# Altium schematic sheet Adapter.SchDoc
size A4
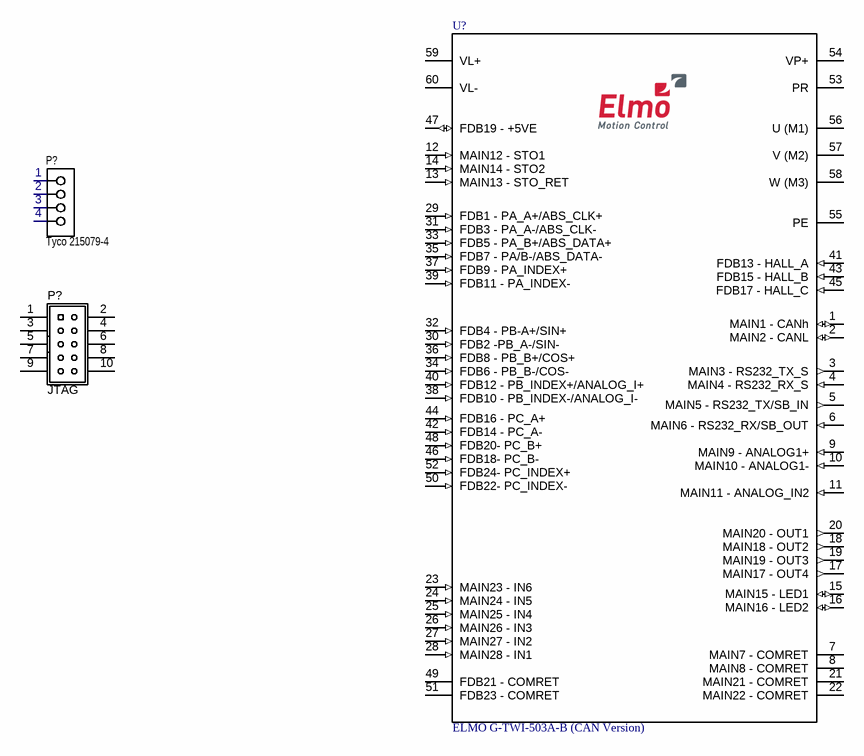
[diagram p0: Adapter.SchDoc]

## Parts
(Parts that share a designator on the sheet are numbered #1, #2 ... from top to bottom, then left to right.)
P?#1  Tyco 215079-4  [TYCO/215079-4]
P?#2  JTAG  [HE/2.54/10/1]
U?  ELMO G-TWI-503A-B (CAN Version)

## Nets

Not connected (* = marked no-connect by the designer): P?#1 1 2 3 4; P?#2 1 2 3 4 5 6 7 8 9 10; U? 1(MAIN1_-_CANh) 2(MAIN2_-_CANL) 3(MAIN3_-_RS232_TX_S) 4(MAIN4_-_RS232_RX_S) 5(MAIN5_-_RS232_TX/SB_IN) 6(MAIN6_-_RS232_RX/SB_OUT) 7(MAIN7_-_COMRET) 8(MAIN8_-_COMRET) 9(MAIN9_-_ANALOG1+) 10(MAIN10_-_ANALOG1-) 11(MAIN11_-_ANALOG_IN2) 12(MAIN12_-_STO1) 13(MAIN13_-_STO_RET) 14(MAIN14_-_STO2) 15(MAIN15_-_LED1) 16(MAIN16_-_LED2) 17(MAIN17_-_OUT4) 18(MAIN18_-_OUT2) 19(MAIN19_-_OUT3) 20(MAIN20_-_OUT1) 21(MAIN21_-_COMRET) 22(MAIN22_-_COMRET) 23(MAIN23_-_IN6) 24(MAIN24_-_IN5) 25(MAIN25_-_IN4) 26(MAIN26_-_IN3) 27(MAIN27_-_IN2) 28(MAIN28_-_IN1) 29(FDB1_-_PA_A+/ABS_CLK+) 30(FDB2_-PB_A-/SIN-) 31(FDB3_-_PA_A-/ABS_CLK-) 32(FDB4_-_PB-A+/SIN+) 33(FDB5_-_PA_B+/ABS_DATA+) 34(FDB6_-_PB_B-/COS-) 35(FDB7_-_PA/B-/ABS_DATA-) 36(FDB8_-_PB_B+/COS+) 37(FDB9_-_PA_INDEX+) 38(FDB10_-_PB_INDEX-/ANALOG_I-) 39(FDB11_-_PA_INDEX-) 40(FDB12_-_PB_INDEX+/ANALOG_I+) 41(FDB13_-_HALL_A) 42(FDB14_-_PC_A-) 43(FDB15_-_HALL_B) 44(FDB16_-_PC_A+) 45(FDB17_-_HALL_C) 46(FDB18-_PC_B-) 47(FDB19_-_+5VE) 48(FDB20-_PC_B+) 49(FDB21_-_COMRET) 50(FDB22-_PC_INDEX-) 51(FDB23_-_COMRET) 52(FDB24-_PC_INDEX+) 53(PR) 54(VP+) 55(PE) 56(U_(M1)) 57(V_(M2)) 58(W_(M3)) 59(VL+) 60(VL-)

## Notes on the sheet
- HEIG-VD/TIN/IAI
- Created
- Route de Cheseaux, 1
- CH-1400 Yverdon-les-Bains
- +41(0)79 317 11 75
- Mod.
- Verified
- Engineer
- Execution
- Standards
- CEI
- A4
- Context
- Project
- Title
- Order#
- Origin
- Version
- Drawing#
- Sheets
- Sheet#

## Library data of the parts
P?#1 = CONN 4 MICROMATCH F4
P?#2 = CONN 10POS
U? = ELMO G-TWI-503A-B (CAN Version): Motion Control